# EasyEDA schematic G1000_Dual_Encoder_Base.json
TITLE: Sheet_1; REV: 1.0; Date: 2024-03-30; Sheet: 1/1; Drawn By: gagagu1; Company: Your Company
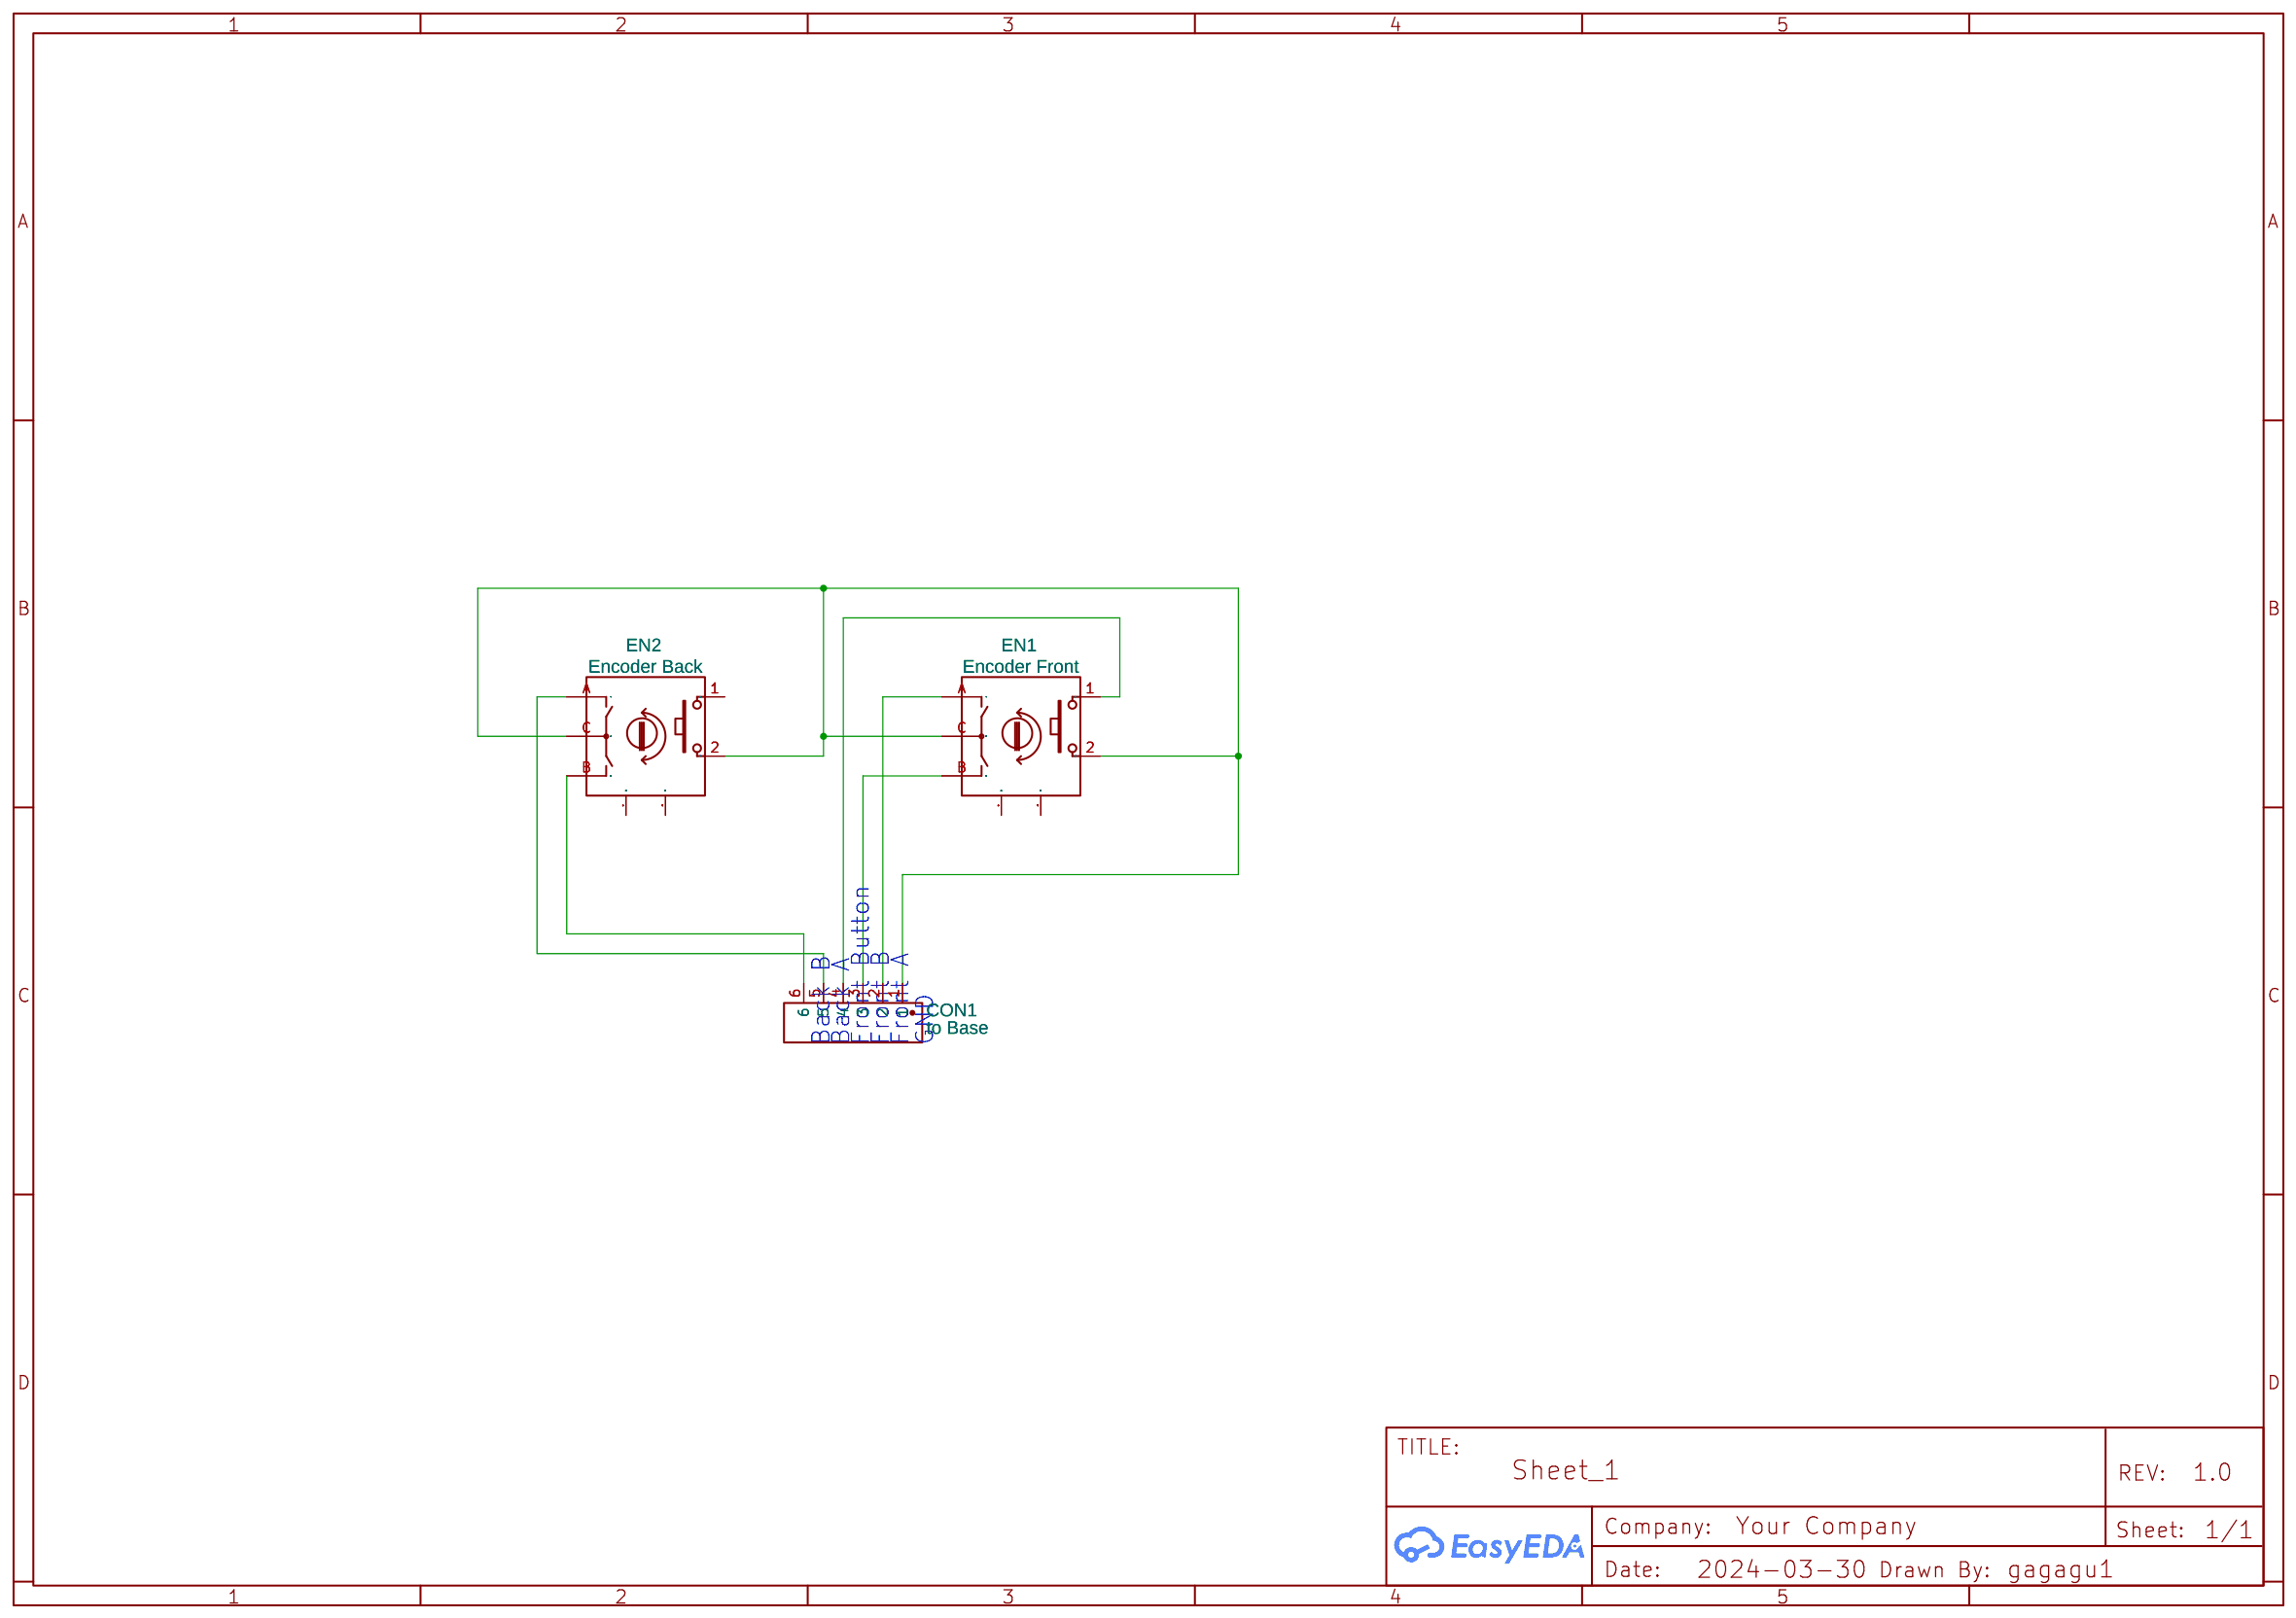
[diagram p0: schematic sheet]

## Parts
CON1  to Base  [ARUN-CONN-TH_XH-6A]
EN1  Encoder Front  [BOURNS_PEC11R-4XXXF-SXXXX]
EN2  Encoder Back  [BOURNS_PEC11R-4XXXF-SXXXX]

## Library data of the parts
CON1 = ARUN-CONN-TH_XH-6A: Supplier: LCSC; Supplier Part: C722879; Manufacturer: CAX; Manufacturer Part: XH-6A; Contributor: LCSC; JLCPCB Part Class: Extended Part
EN1 EN2 = PEC11R-4015F-S0024: Supplier: LCSC; Supplier Part: C143789; Manufacturer: BOURNS; Contributor: Yarik_UA

## Nets
Net-(CON1-1): CON1.1 EN1.2 EN1.C EN2.2 EN2.C
Net-(CON1-2): CON1.2 EN1.A
Net-(CON1-3): CON1.3 EN1.B
Net-(CON1-4): CON1.4 EN1.1
Net-(CON1-5): CON1.5 EN2.A
Net-(CON1-6): CON1.6 EN2.B

Not connected (* = marked no-connect by the designer): EN1 MT1 MT2; EN2 1 MT1 MT2

## Notes on the sheet
- Back B
- Back A
- Front Button
- Front B
- Front A
- GND
